# EasyEDA schematic SCH_PIF_Line_Follower_2024-01-01 (1).json
TITLE: Sheet_1; REV: 1.0; Date: 2023-12-30; Sheet: 1/1; Drawn By: Crypt-PCB; Company: PIF Avenger
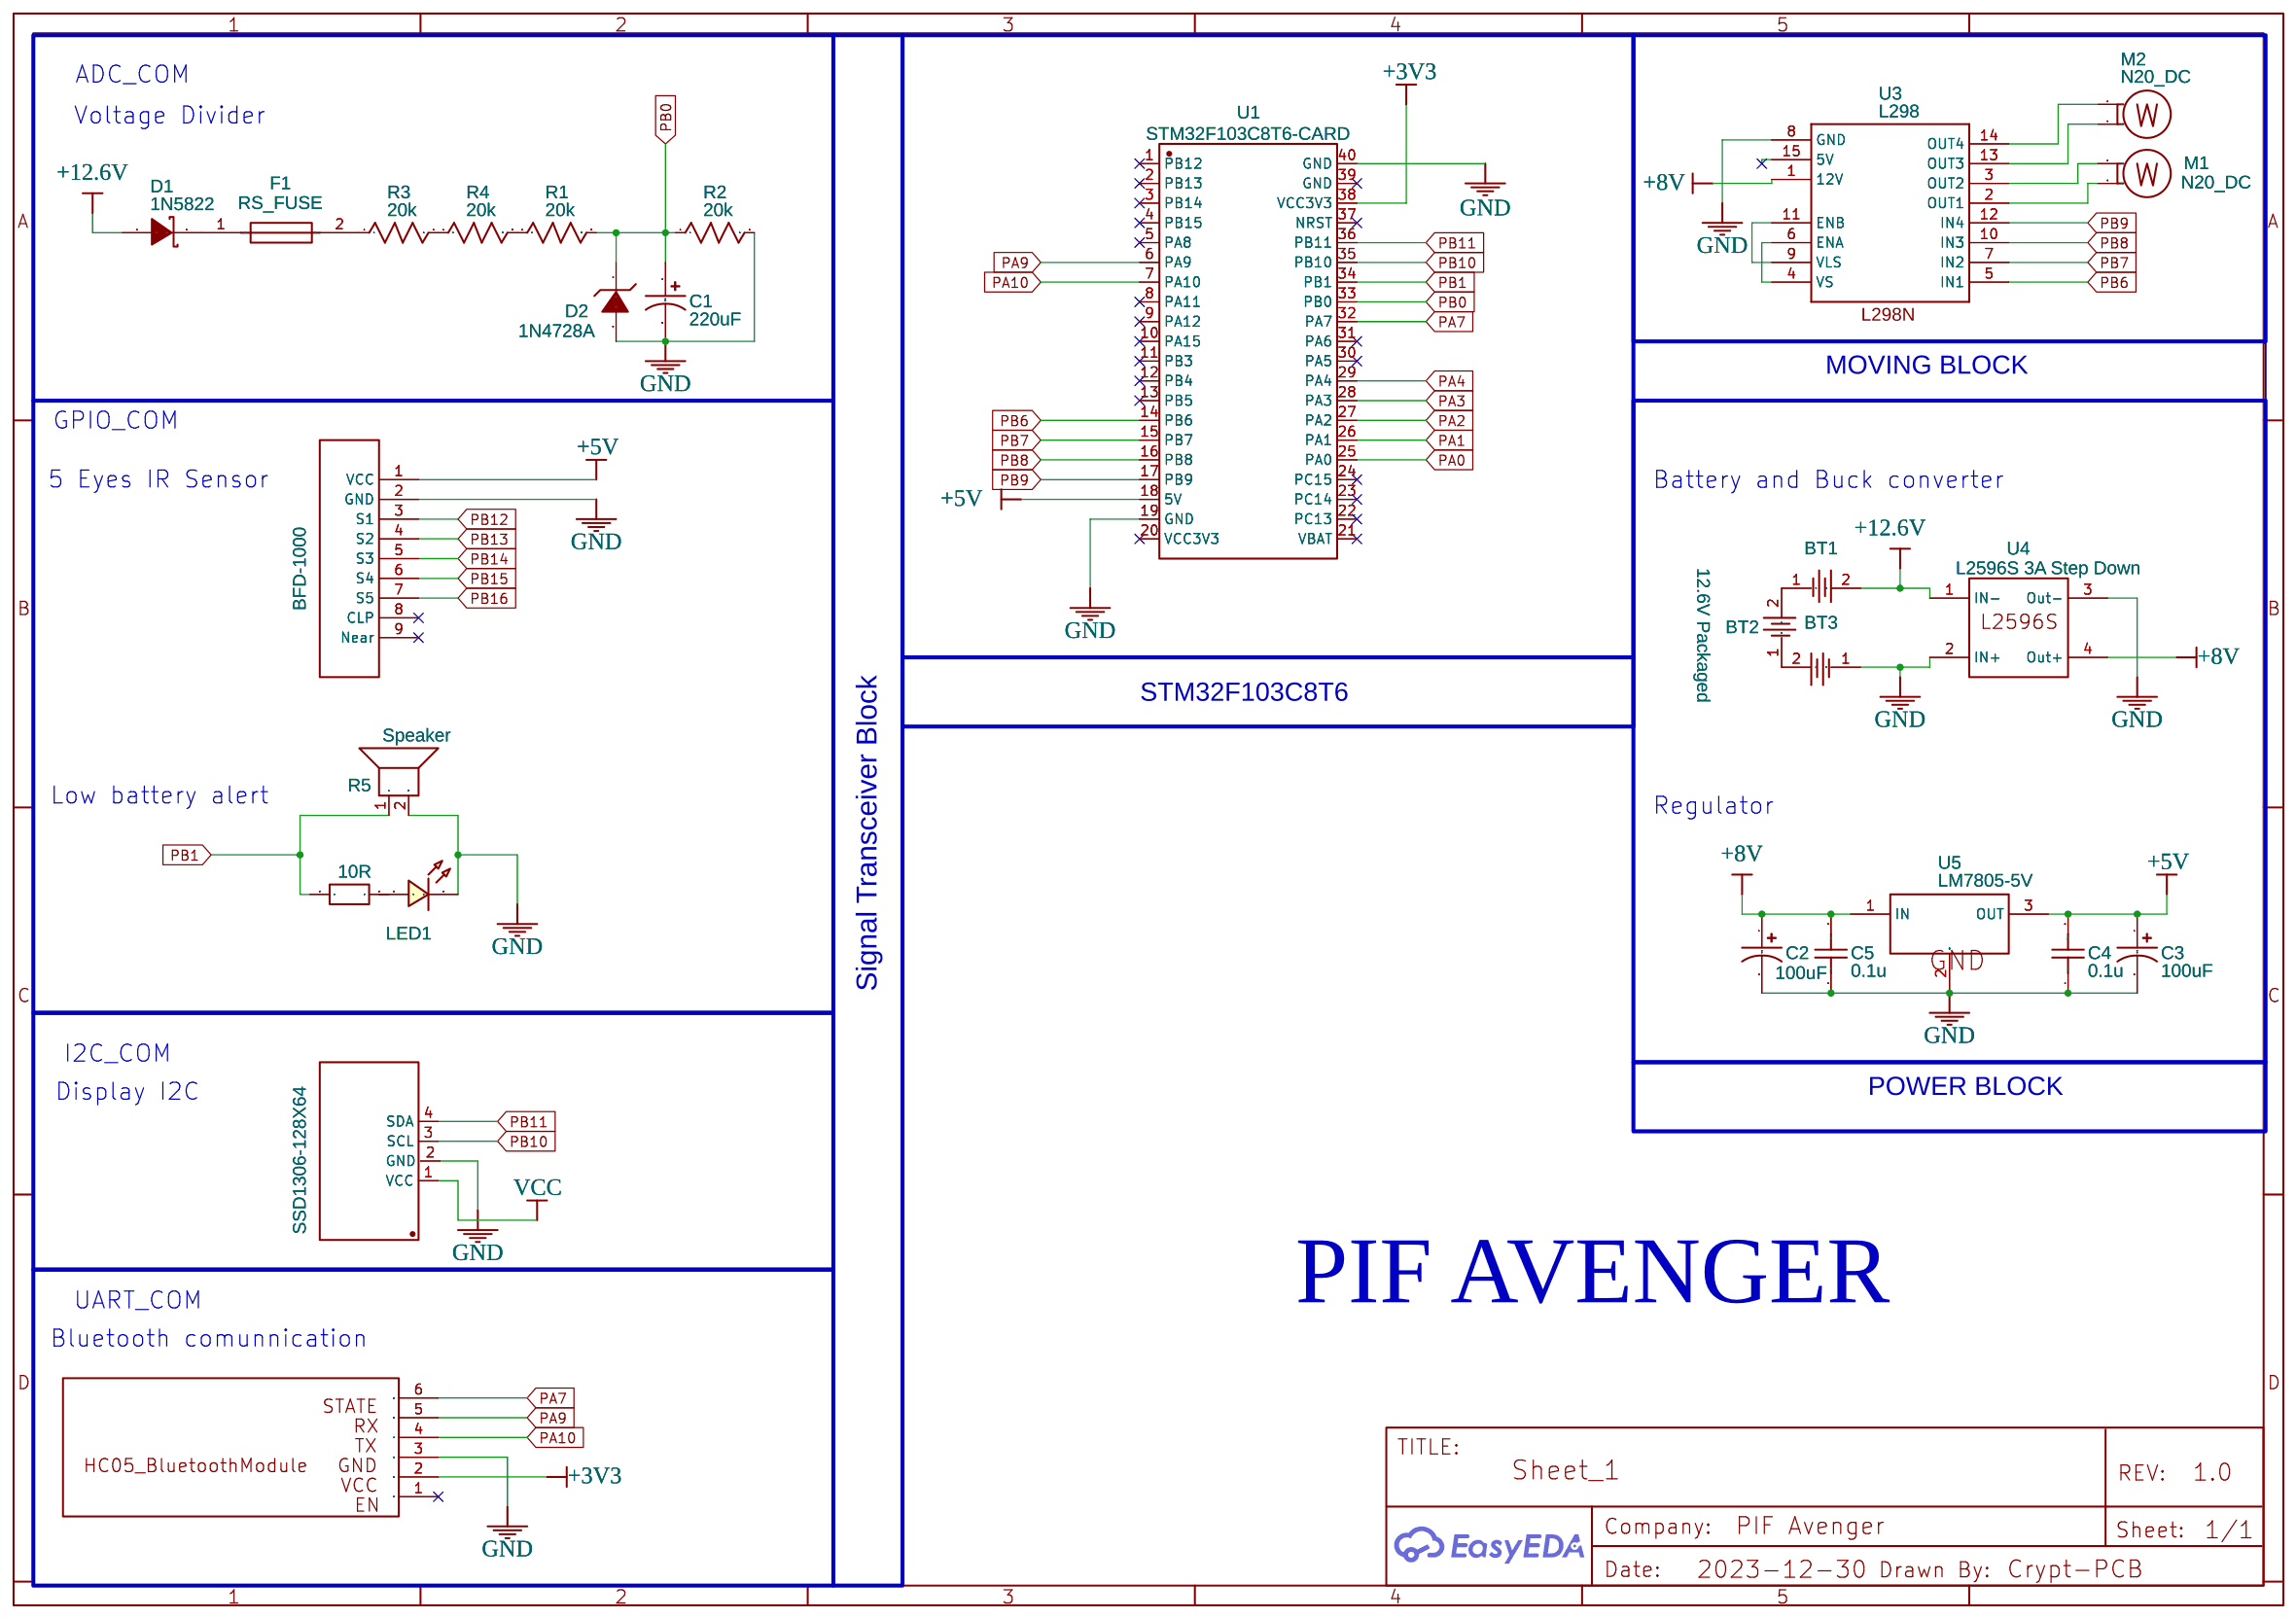
[diagram p0: schematic sheet]

## Parts
BT1  BH-18650-A1AJ006  [BAT-TH_BH-18650-A1AJ006]
BT2  12.6V Packaged  [BAT-TH_BH-18650-A1AJ006]
BT3  BH-18650-A1AJ006  [BAT-TH_BH-18650-A1AJ006]
C1  220uF  [CAP-D4.0×F1.5]
C2  100uF  [CAP-D4.0×F1.5]
C3  100uF  [CAP-D4.0×F1.5]
C4  0.1u  [C0603]
C5  0.1u  [C0603]
D1  1N5822  [DO-201AD_BD5.3-L8.4-P12.50-D1.4-FD]
D2  1N4728A  [DO-41_BD2.4-L4.7-P8.70-D0.9-RD]
F1  RS_FUSE  [FUSE-TH-L12.5-W2.0-P5.00-D0.8]
LED1  LED-0603_R  [LED0603_RED]
LS1  Speaker  [SPEAKER-PADS]
M1  N20_DC
M2  N20_DC
PCB1  SSD1306-128X64  [SSD1306]
R1  20k  [R0603]
R2  20k  [R0603]
R3  20k  [R0603]
R4  20k  [R0603]
R5  10R  [R0603]
U1  STM32F103C8T6-CARD  [CONN-TH_L53.3-W22.9_STM32F103C8T6-CARD]
U2  HC_05_Bluetooth
U3  L298  [L298N]
U4  L2596S 3A Step Down  [L2596S STEPDOWN 3A MODUL]
U5  LM7805-5V  [TO-252-2_L6.6-W6.1-P4.58-LS9.9-TL]
U6  BFD-1000

## Library data of the parts
BT1-BT3 = BH-18650-A1AJ006: Supplier: LCSC; Supplier Part: C5290175; Manufacturer: MYOUNG(美阳); JLCPCB Part Class: Extended Part; Contributor: lcsc
C1-C3 = CE_TH_D4.0×F1.5_US: Contributor: LCEDA_Lib
C4 C5 = C_0603_US: Contributor: LCEDA_Lib
D1 = 1N5822: Supplier: LCSC; Manufacturer: MDD; Supplier Part: C2476; JLCPCB Part Class: Extended Part
D2 = 1N4728A_C140852: Contributor: LCSC; Supplier: LCSC; Supplier Part: C140852; Manufacturer: onsemi(安森美); JLCPCB Part Class: Extended Part
F1 = RESETTABLEFUSE-500MA: Contributor: LCSC; Supplier: LCSC; Supplier Part: C9900007669; Manufacturer: null; Manufacturer Part: ResettableFuse-500mA; JLCPCB Part Class: Extended Part
LED1 = LED-0603_R: Manufacturer: EVERLIGHT(台湾亿光); Manufacturer Part: 19-217/R6C-AL1M2VY/3T; Supplier Part: C72044; Supplier: LCSC; Contributor: LCEDA_01
LS1 = Speaker: Contributor: virtualgt; license: https://www.gnu.org/licenses/lgpl-2.1.html
M1 M2 = N20_DC: Supplier: CryptPCB; Contributor: crypt-pcb
PCB1 = SSD1306-128X64-OLED-0.96 COPY: sourceId: wICUcuL3l
R1-R4 = R_0603_US: Contributor: LCEDA_Lib
R5 = R_0603_EU: Contributor: LCEDA_Lib
U1 = STM32F103C8T6-CARD: Supplier: LCSC; Supplier Part: C9900077949; Manufacturer: null; Manufacturer Part: STM32F103C8T6-Card; Contributor: lcsc
U2 = HC_05_Bluetooth: Supplier: CryptPCB; Contributor: Crypt-PCB
U3 = L298: Manufacturer Part: L298N Driver; Supplier: SeeedStudio; Contributor: huynhthienphu2492001
U4 = L2596S 3A Step Down: Contributor: St1fT
U5 = LM7805-5V: Contributor: LCSC; Supplier: LCSC; Supplier Part: C9900008050; Manufacturer: null; JLCPCB Part Class: Extended Part
U6 = BFD-1000: Contributor: mrpivato

## Nets
+3V3: U1.38(VCC3V3) U2.2
+5V: C3.1 C4.2 U1.18(5V) U5.3(OUT) U6.1(VCC)
+8V: C2.1 C5.2 U3.1(12V) U4.4(Out+) U5.1(IN)
+12.6V: BT1.2 D1.1(A) U4.1(IN-)
GND: BT3.1 C1.2 C2.2 C3.2 C4.1 C5.1 D2.2(A) LED1.2 LS1.2 PCB1.2(GND) R2.2 U1.19(GND) U1.40(GND) U2.3 U3.8(GND) U4.2(IN+) U4.3(Out-) U5.2(GND) U6.2(GND)
VCC: PCB1.1(VCC)
PA0: U1.25(PA0)
PA1: U1.26(PA1)
PA2: U1.27(PA2)
PA3: U1.28(PA3)
PA4: U1.29(PA4)
PA7: U1.32(PA7) U2.6
PA9: U1.6(PA9) U2.5
PA10: U1.7(PA10) U2.4
PB0: C1.1 D2.1(K) R1.2 R2.1 U1.33(PB0)
PB1: LS1.1 R5.1 U1.34(PB1)
PB6: U1.14(PB6) U3.5(IN1)
PB7: U1.15(PB7) U3.7(IN2)
PB8: U1.16(PB8) U3.10(IN3)
PB9: U1.17(PB9) U3.12(IN4)
PB10: PCB1.3(SCL) U1.35(PB10)
PB11: PCB1.4(SDA) U1.36(PB11)
PB12: U6.3(S1)
PB13: U6.4(S2)
PB14: U6.5(S3)
PB15: U6.6(S4)
PB16: U6.7(S5)
Net-(BT1-1): BT1.1 BT2.2
Net-(BT2-1): BT2.1 BT3.2
Net-(D1-2): D1.2(K) F1.1
Net-(F1-2): F1.2 R3.1
Net-(M1-1): M1.1(-) U3.3(OUT2)
Net-(M1-2): M1.2(+) U3.2(OUT1)
Net-(M2-1): M2.1(-) U3.14(OUT4)
Net-(M2-2): M2.2(+) U3.13(OUT3)
Net-(R1-1): R1.1 R4.2
Net-(R3-2): R3.2 R4.1
Net-(U3-4): U3.4(VS) U3.6(ENA)
Net-(U3-9): U3.9(VLS) U3.11(ENB)

Not connected (* = marked no-connect by the designer): LED1 1; R5 2; U1 1(PB12)* 2(PB13)* 3(PB14)* 4(PB15)* 5(PA8)* 8(PA11)* 9(PA12)* 10(PA15)* 11(PB3)* 12(PB4)* 13(PB5)* 20(VCC3V3)* 21(VBAT)* 22(PC13)* 23(PC14)* 24(PC15)* 30(PA5)* 31(PA6)* 37(NRST)* 39(GND)*; U2 1*; U3 15(5V); U6 8(CLP)* 9(Near)*

## Notes on the sheet
- ADC_COM
- Voltage Divider
- MOVING BLOCK
- GPIO_COM
- 5 Eyes IR Sensor
- Battery and Buck converter
- Signal Transceiver Block
- STM32F103C8T6
- Low battery alert
- Regulator
- I2C_COM
- Display I2C
- POWER BLOCK
- PIF AVENGER
- UART_COM
- Bluetooth comunnication
